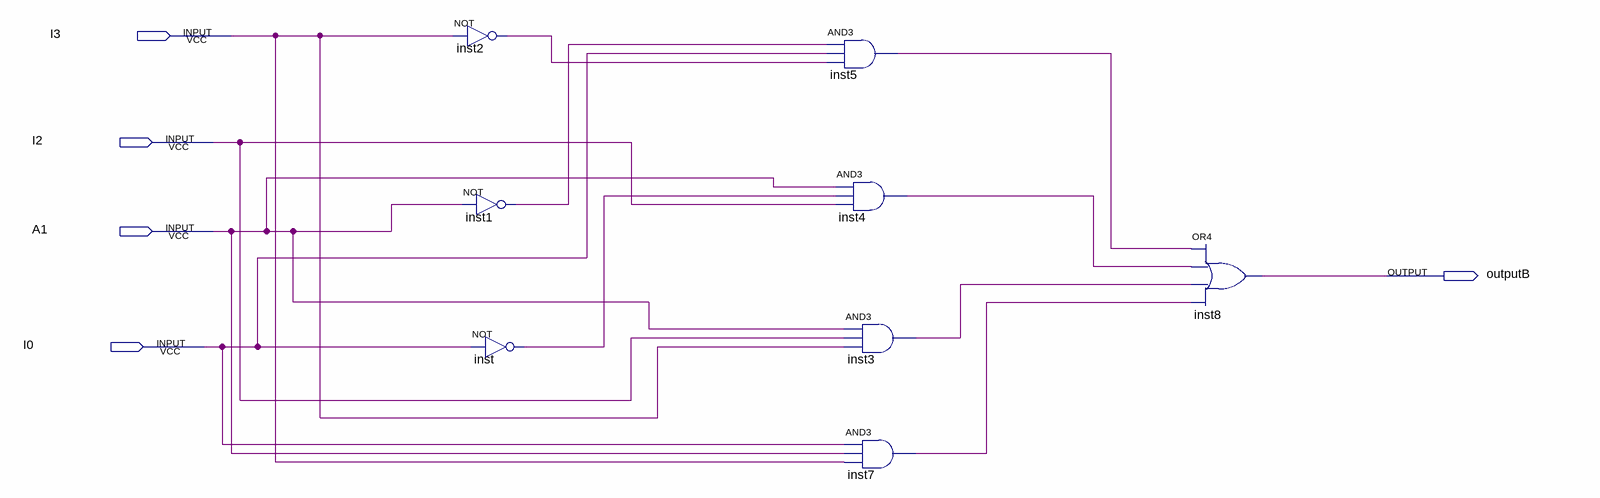
[diagram p0: schematic sheet]
// Quartus schematic outputB.bdf as structural Verilog: 8 symbols, 5 pins
module outputB (
  input  I3,
  input  I2,
  input  A1,
  input  I0,
  output outputB
);

  wire inst1_out, inst2_out, inst3_out, inst4_out, inst5_out, inst7_out, inst_out;

  not inst2 (inst2_out, I3);
  not inst1 (inst1_out, A1);
  not inst (inst_out, I0);
  and inst5 (inst5_out, inst1_out, I0, inst2_out);
  and inst4 (inst4_out, A1, inst_out, I2);
  and inst3 (inst3_out, A1, I2, I3);
  and inst7 (inst7_out, I0, A1, I3);
  or inst8 (outputB, inst5_out, inst4_out, inst3_out, inst7_out);
endmodule
